# Altium schematic sheet 6-INTERCONNECT_MAP.SchDoc: SIGNAL CONDITOINING
size A3; Author: Alexandre Cosneau; CompanyName: Tristar Multicopters; DrawnBy: Alexandre Cosneau; Engineer: Alexandre Cosneau; Organization: Tristar Multicopters; Address1: Genie / GEGI; Address2: 2500 boulevard de l'universite; Address3: J1K2R SHERBROOKE; Address4: QUEBEC, CANADA; DocumentNumber: 15; Revision: 1.0; SheetNumber: 15; SheetTotal: 15
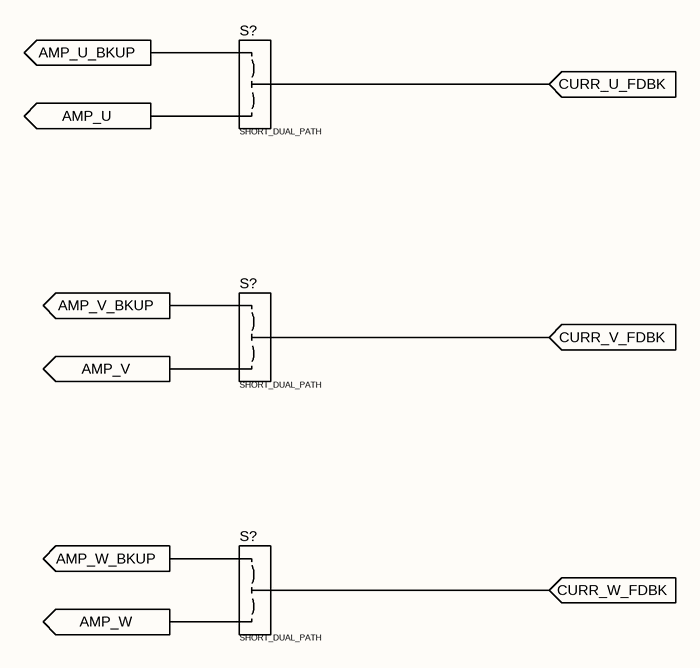
[diagram p0: 6-INTERCONNECT_MAP.SchDoc]

## Parts
(Parts that share a designator on the sheet are numbered #1, #2 ... from top to bottom, then left to right.)
S?#1  SHORT_DUAL_PATH  [SHORT_DUAL_PATH]  (net tie, no BOM)
S?#2  SHORT_DUAL_PATH  [SHORT_DUAL_PATH]  (net tie, no BOM)
S?#3  SHORT_DUAL_PATH  [SHORT_DUAL_PATH]  (net tie, no BOM)

## Ports
AMP_U (out), AMP_U_BKUP (out), AMP_V (out), AMP_V_BKUP (out), AMP_W (out), AMP_W_BKUP (out), CURR_U_FDBK (in), CURR_V_FDBK (in), CURR_W_FDBK (in)

## Nets
AMP_U: S?#1.2 ; port AMP_U
AMP_U_BKUP: S?#1.3 ; port AMP_U_BKUP
AMP_V: S?#2.2 ; port AMP_V
AMP_V_BKUP: S?#2.3 ; port AMP_V_BKUP
AMP_W: S?#3.2 ; port AMP_W
AMP_W_BKUP: S?#3.3 ; port AMP_W_BKUP
CURR_U_FDBK: S?#1.1 ; port CURR_U_FDBK
CURR_V_FDBK: S?#2.1 ; port CURR_V_FDBK
CURR_W_FDBK: S?#3.1 ; port CURR_W_FDBK

## Notes on the sheet
- Title:
- Size:
- Date:
- File:
- E
- Revision:
- Time:
- Author:
- Sheet
- of

## Library data of the parts
S?#1-S?#3 = SHORT_DUAL_PATH: SHORTABLE PARALLEL DUAL PATH LINK